# Altium schematic sheet 1_P1.schdoc
size 429 x 307 mm; Symbol: Sheet-Symbol_A4; Device: Sheet-Symbol_A4; Company: terrence@tenclass.com; Version: V3.2; Page Size: A4; @Project Name: 小x宝bot; @Page Count: 1; @Update Date: 2025-09-04; @Create Date: 2025-09-04; @Schematic Name: SCH_3636_v3; @Page No: 1; @Page Name: P1; @Board Name: c3_8311_3636_v3; @Create Time: 12:12:51; @Update Time: 12:13:00; Width: 1655; Height: 1170; Region Start: 1; X Region Count: 6; Y Region Count: 4; Blade Width: 10; Title Block Position: 3
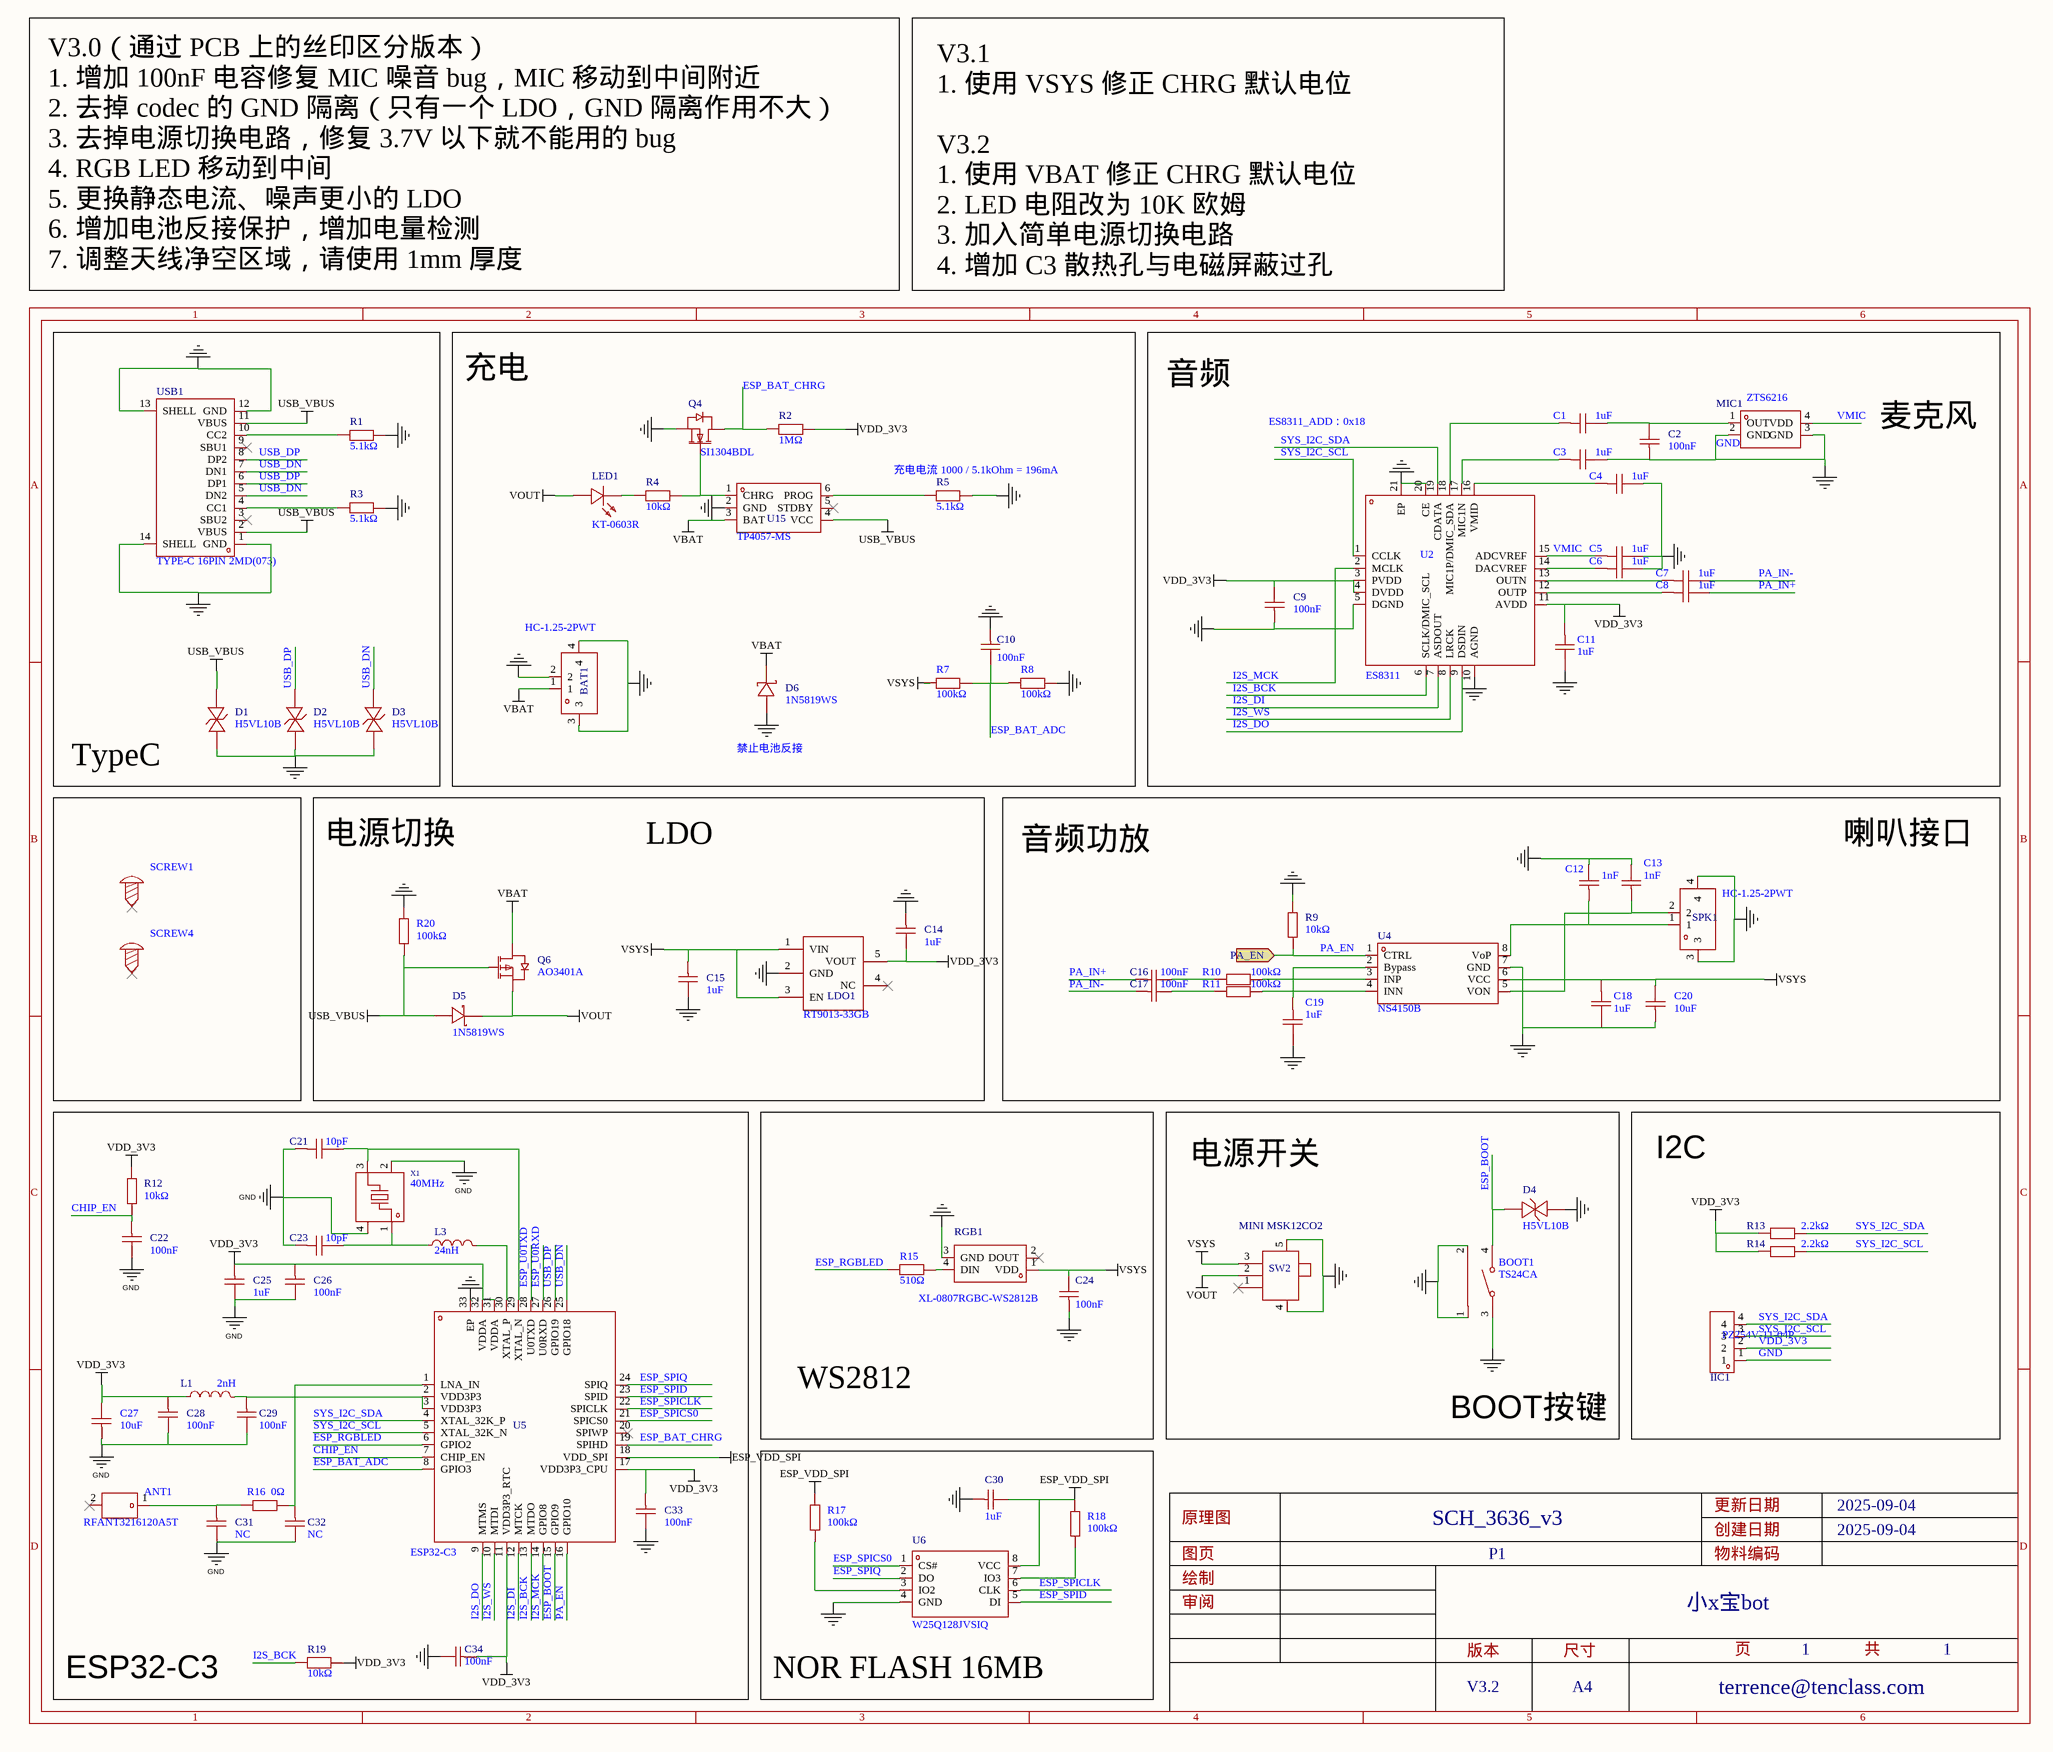
[diagram p0: 1_P1.schdoc]

## Parts
ANT1  RFANT3216120A5T  [FILTER-SMD_1206-2P-L3.2-W1.6-L]
BAT1  HC-1.25-2PWT  [CONN-SMD_2P-P1.25-HC-1.25-2PWT]
BOOT1  TS24CA  [SW-SMD_TS24CA]
C1  1uF  [C0402]
C2  100nF  [C0402]
C3  1uF  [C0402]
C4  1uF  [C0402]
C5  1uF  [C0402]
C6  1uF  [C0402]
C7  1uF  [C0402]
C8  1uF  [C0402]
C9  100nF  [C0402]
C10  100nF  [C0402]
C11  1uF  [C0402]
C12  1nF  [C0402]
C13  1nF  [C0402]
C14  1uF  [C0402]
C15  1uF  [C0402]
C16  100nF  [C0402]
C17  100nF  [C0402]
C18  1uF  [C0402]
C19  1uF  [C0402]
C20  10uF  [C0402]
C21  10pF  [C0402]
C22  100nF  [C0402]
C23  10pF  [C0402]
C24  100nF  [C0402]
C25  1uF  [C0402]
C26  100nF  [C0402]
C27  10uF  [C0402]
C28  100nF  [C0402]
C29  100nF  [C0402]
C30  1uF  [C0402]
C31  NC  [C0402]
C32  NC  [C0402]
C33  100nF  [C0402]
C34  100nF  [C0402]
D1  H5VL10B  [SOD-882_L1.0-W0.6-BI]
D2  H5VL10B  [SOD-882_L1.0-W0.6-BI]
D3  H5VL10B  [SOD-882_L1.0-W0.6-BI]
D4  H5VL10B  [SOD-882_L1.0-W0.6-BI]
D5  1N5819WS  [SOD-323_L1.8-W1.3-LS2.5-RD]
D6  1N5819WS  [SOD-323_L1.8-W1.3-LS2.5-RD]
IIC1  PZ254V-11-04P  [HDR-TH_4P-P2.54-V-M]
L1  2nH  [L0402]
L3  24nH  [L0402-RD]
LDO1  RT9013-33GB  [SOT-23-5_L3.0-W1.7-P0.95-LS2.8-BL]
LED1  KT-0603R  [LED0603-RD]
MIC1  ZTS6216  [MIC-SMD_4P-L2.8-W1.9-P1.84-TL]
Q4  SI1304BDL  [SOT-323-3_L2.0-W1.3-P1.30-LS2.1-BL]
Q6  AO3401A  [SOT-23_L2.9-W1.3-P1.90-LS2.4-BR]
R1  5.1kΩ  [R0402]
R2  1MΩ  [R0402]
R3  5.1kΩ  [R0402]
R4  10kΩ  [R0402]
R5  5.1kΩ  [R0402]
R7  100kΩ  [R0402]
R8  100kΩ  [R0402]
R9  10kΩ  [R0402]
R10  100kΩ  [R0402]
R11  100kΩ  [R0402]
R12  10kΩ  [R0402]
R13  2.2kΩ  [R0402]
R14  2.2kΩ  [R0402]
R15  510Ω  [R0402]
R16  0Ω  [R0402]
R17  100kΩ  [R0402]
R18  100kΩ  [R0402]
R19  10kΩ  [R0402]
R20  100kΩ  [R0402]
RGB1  XL-0807RGBC-WS2812B  [LED-SMD_4P-L2.0-W1.8_CY-0807]
SCREW1  (no value)  [M2螺丝]
SCREW4  (no value)  [M2螺丝]
SPK1  HC-1.25-2PWT  [CONN-SMD_2P-P1.25-HC-1.25-2PWT]
SW2  MINI MSK12CO2  [SW-SMD_MSK12CO2]
U2  ES8311  [WQFN-20_L3.0-W3.0-P0.40-BL-EP1.7]
U4  NS4150B  [MSOP-8_L3.0-W3.0-P0.65-LS5.0-BL]
U5  ESP32-C3  [QFN-32_L5.0-W5.0-P0.50-TL-EP3.7]
U6  W25Q128JVSIQ  [SOIC-8_L5.3-W5.3-P1.27-LS8.0-BL]
U15  TP4057-MS  [SOT-23-6_L2.9-W1.6-P0.95-LS2.8-BL]
USB1  TYPE-C 16PIN 2MD(073)  [USB-C-SMD_TYPE-C-6PIN-2MD-073]
X1  40MHz  [CRYSTAL-SMD_4P-L2.5-W2.0-BL]

## Blocks framed on the sheet
TypeC: D1-D3 R1 R3 USB1
充电: BAT1 C10 D6 LED1 Q4 R2 R4 R5 R7 R8 U15
ESP32-C3: ANT1 C21-C23 C25-C29 C31-C34 L1 L3 R12 R16 R19 U5 X1
WS2812: C24 R15 RGB1
I2C: IIC1 R13 R14
NOR FLASH 16MB: C30 R17 R18 U6

## Ports
PA_EN (in)

## Nets
ESP_VDD_SPI: C30.2 R17.2 R18.2 U5.18(VDD_SPI) U6.8(VCC)
GND: BAT1.2 BAT1.3 BAT1.4 BOOT1.1 BOOT1.2 BOOT1.3 C2.1 C3.1 C4.1 C5.1 C6.1 C9.1 C10.1 C11.1 C12.2 C13.2 C14.1 C15.2 C18.1 C19.1 C20.1 C21.2 C22.2 C23.2 C24.1 C25.2 C26.2 C27.1 C28.2 C29.2 C30.1 C31.2 C32.2 C33.2 C34.2 D1.2(A) D2.2(A) D3.2(A) D4.2(A) D6.2(A) IIC1.1 LDO1.2(GND) MIC1.2(GND) MIC1.3(GND) Q4.2(S) R1.2 R3.2 R5.2 R8.2 R9.2 R20.2 RGB1.3(GND) SPK1.3 SPK1.4 SW2.4 SW2.5 U2.5(DGND) U2.10(AGND) U2.20(CE) U2.21(EP) U4.7(GND) U5.33(EP) U6.4(GND) U15.2(GND) USB1.1(GND) USB1.12(GND) USB1.13(SHELL) USB1.14(SHELL) X1.2(GND) X1.4(GND)
USB_VBUS: D1.1(C) D5.2(A) Q6.1(G) R20.1 U15.4(VCC) USB1.2(VBUS) USB1.11(VBUS)
VBAT: BAT1.1 D6.1(K) Q6.3(D) U15.3(BAT)
VDD_3V3: C9.2 C11.2 C14.2 C25.1 C26.1 C27.2 C28.1 C33.1 C34.1 IIC1.2 L1.1 LDO1.5(VOUT) R2.1 R12.1 R13.2 R14.2 R19.1 U2.3(PVDD) U2.4(DVDD) U2.11(AVDD) U5.11(VDD3P3_RTC) U5.17(VDD3P3_CPU) U5.31(VDDA) U5.32(VDDA)
VOUT: D5.1(K) LED1.2(A) Q6.2(S) SW2.2
VSYS: C15.1 C18.2 C20.2 C24.2 LDO1.1(VIN) LDO1.3(EN) R7.1 RGB1.1(VDD) SW2.3 U4.6(VCC)
CHIP_EN: C22.1 R12.2 U5.7(CHIP_EN)
ESP_BAT_ADC: C10.2 R7.2 R8.1 U5.8(GPIO3)
ESP_BAT_CHRG: Q4.3(D) R2.2 U5.19(SPIHD)
ESP_BOOT: BOOT1.4 D4.1(C) U5.15(GPIO9)
ESP_RGBLED: R15.2 U5.6(GPIO2)
ESP_SPICLK: U5.22(SPICLK) U6.6(CLK)
ESP_SPICS0: U5.21(SPICS0) U6.1(CS#)
ESP_SPID: U5.23(SPID) U6.5(DI)
ESP_SPIQ: U5.24(SPIQ) U6.2(DO)
ESP_U0RXD: U5.27(U0RXD)
ESP_U0TXD: U5.28(U0TXD)
I2S_BCK: R19.2 U2.6(SCLK/DMIC_SCL) U5.13(MTDO)
I2S_DI: U2.7(ASDOUT) U5.12(MTCK)
I2S_DO: U2.9(DSDIN) U5.9(MTMS)
I2S_MCK: U2.2(MCLK) U5.14(GPIO8)
I2S_WS: U2.8(LRCK) U5.10(MTDI)
PA_EN: R9.1 U4.1(CTRL) U5.16(GPIO10) ; port PA_EN
PA_IN+: C8.1 C16.1
PA_IN-: C7.1 C17.1
SYS_I2C_SCL: IIC1.3 R14.1 U2.1(CCLK) U5.5(XTAL_32K_N)
SYS_I2C_SDA: IIC1.4 R13.1 U2.19(CDATA) U5.4(XTAL_32K_P)
USB_DN: D3.1(C) U5.25(GPIO18) USB1.5(DN2) USB1.7(DN1)
USB_DP: D2.1(C) U5.26(GPIO19) USB1.6(DP1) USB1.8(DP2)
VMIC: C5.2 MIC1.4(VDD) U2.15(ADCVREF)
NetANT1_1: ANT1.1 C31.1 R16.1
NetC1_1: C1.1 C2.2 MIC1.1(OUT)
NetC1_2: C1.2 U2.18(MIC1P/DMIC_SDA)
NetC3_2: C3.2 U2.17(MIC1N)
NetC4_2: C4.2 U2.16(VMID)
NetC6_2: C6.2 U2.14(DACVREF)
NetC7_2: C7.2 U2.13(OUTN)
NetC8_2: C8.2 U2.12(OUTP)
NetC12_1: C12.1 SPK1.1 U4.8(VoP)
NetC13_1: C13.1 SPK1.2 U4.5(VON)
NetC16_2: C16.2 R10.2
NetC17_2: C17.2 R11.2
NetC19_2: C19.2 U4.2(Bypass)
NetC21_1: C21.1 U5.29(XTAL_N) X1.3
NetC23_1: C23.1 L3.1 X1.1
NetC29_1: C29.1 L1.2 U5.2(VDD3P3) U5.3(VDD3P3)
NetC32_1: C32.1 R16.2 U5.1(LNA_IN)
NetL3_2: L3.2 U5.30(XTAL_P)
NetLED1_1: LED1.1(K) R4.1
NetQ4_1: Q4.1(G) R4.2 U15.1(CHRG)
NetR1_1: R1.1 USB1.10(CC2)
NetR3_1: R3.1 USB1.4(CC1)
NetR5_1: R5.1 U15.6(PROG)
NetR10_1: R10.1 U4.3(INP)
NetR11_1: R11.1 U4.4(INN)
NetR15_1: R15.1 RGB1.4(DIN)
NetR17_1: R17.1 U6.3(IO2)
NetR18_1: R18.1 U6.7(IO3)

Not connected (* = marked no-connect by the designer): ANT1 2*; LDO1 4(NC)*; RGB1 2(DOUT)*; SCREW1 1*; SCREW4 1*; SW2 1*; U5 20(SPIWP)*; U15 5(STDBY)*; USB1 3(SBU2)* 9(SBU1)*

## Notes on the sheet
- V3.0（通过 PCB 上的丝印区分版本）
  1. 增加 100nF 电容修复 MIC 噪音 bug，MIC 移动到中间附近
  2. 去掉 codec 的 GND 隔离（只有一个 LDO，GND 隔离作用不大）
  3. 去掉电源切换电路，修复 3.7V 以下就不能用的 bug
  4. RGB LED 移动到中间
  5. 更换静态电流、噪声更小的 LDO
  6. 增加电池反接保护，增加电量检测
  7. 调整天线净空区域，请使用 1mm 厚度
- V3.1
  1. 使用 VSYS 修正 CHRG 默认电位
  V3.2
  1. 使用 VBAT 修正 CHRG 默认电位
  2. LED 电阻改为 10K 欧姆
  3. 加入简单电源切换电路
  4. 增加 C3 散热孔与电磁屏蔽过孔
- 音频
- ES8311_ADD：0x18
- 麦克风
- (near R5) 充电电流 1000 / 5.1kOhm = 196mA
- 禁止电池反接
- 电源切换
- LDO
- 音频功放
- 喇叭接口
- 电源开关
- BOOT按键
- 1
- 2
- 3
- 4
- 5
- 6
- A
- B
- C
- 原理图
- SCH_3636_v3
- 创建日期
- 更新日期
- 2025-09-04
- D
- 绘制
- 图页
- P1
- 物料编码
- 审阅
- 版本
- 尺寸
- 小x宝bot
- 页
- 共
- V3.2
- A4
- terrence@tenclass.com

## Library data of the parts
ANT1 = RFANT3216120A5T: Manufacturer: Walsin(华新科); Add into BOM: yes; Antenna Type: 芯片天线; Central Frequency: 2.4GHz; Peak Gain: 2dBi; VSWR: 2; Symbol: RFANT3216120A5T; Device: RFANT3216120A5T; LCSC Part Name: 2.4GHz ISM频段工作频率的多层陶瓷天线; Supplier Part: C127629; Manufacturer Part: RFANT3216120A5T; Supplier Footprint: 1206; JLCPCB Part Class: Extended Part; Datasheet: https://atta.szlcsc.com/upload/public/pdf/source/20180326/C127629_E7A81F7A36316F7BB6F0FA74BB27F225.pdf; Supplier: LCSC; Convert to PCB: yes; Bandwidth: -; Polarization Type: -; Impedance: -; Power capacity: -; Operating Temperature: -40℃~+85℃
BAT1 SPK1 = HC-1.25-2PWT: Manufacturer: HCTL(华灿天禄); Add into BOM: yes; Pins Structure: 1x2P; Pitch: 1.25mm; Reference Series: PicoBlade(MX 1.25); Number of PINs Per Row: 2; Current Rating (Max): 1A; Rated Voltage (Max): 125V; Plastic Material: LCP; Flame Retardant Rating: UL94V-0; Supplementary Features: 辅助焊脚; Z-Height of the Board: 3.57mm; X-Length of Bottom Edge on Board (Spacing Line): 7.55mm; Y-Width of Bottom Edge on Board: 5.25mm; Symbol: HC-1.25-2PWT; Device: HC-1.25-2PWT; LCSC Part Name: 1x2P 间距:1.25mm 卧贴 系列:PicoBlade(MX 1.25); Supplier Part: C2845379; Manufacturer Part: HC-1.25-2PWT; Supplier Footprint: SMD,P=1.25mm,卧贴; JLCPCB Part Class: Extended Part; Datasheet: https://atta.szlcsc.com/upload/public/pdf/source/20240930/9508A8292CCC87B0C29E3A028D56E30A.pdf; Supplier: LCSC; Convert to PCB: yes; Mounting Style: 卧贴; Number of Pins: 2P; Number of Rows: 1; Row Spacing: -; Contact Material: 黄铜; Contact Plating: 锡; Operating Temperature Range: -40℃~+105℃; Colour: -
BOOT1 = TS24CA: Manufacturer: SHOU HAN(首韩); Add into BOM: yes; Circuit: 单刀单掷; Actuator Style: 矩形按钮; Switch Length: 4.55mm; Switch Width: 1.8mm; Switch Height: 3.5mm; Contact Current: 50mA; Voltage Rating (DC): 12V; Symbol: TS24CA; Device: TS24CA; LCSC Part Name: 4.55*1.8*3.5mm 卧贴 轻触开关; Supplier Part: C393942; Manufacturer Part: TS24CA; Supplier Footprint: SMD; JLCPCB Part Class: Extended Part; Datasheet: https://atta.szlcsc.com/upload/public/pdf/source/20190521/C393942_591A9E318887EFA4274D34029981AD99.pdf; Supplier: LCSC; Convert to PCB: yes; Mounting Style: 卧贴; With Lamp: -; Mechanical Life: -
C1 C3 = CL05A105KA5NQNC: Manufacturer: SAMSUNG(三星); Add into BOM: yes; Tolerance: ±10%; Voltage Rated: 25V; Temperature Coefficient: X5R; Symbol: CL05A105KA5NQNC; Device: CL05A105KA5NQNC; LCSC Part Name: 1uF ±10% 25V; Supplier Part: C52923; Manufacturer Part: CL05A105KA5NQNC; Supplier Footprint: 0402; JLCPCB Part Class: Basic Part; Datasheet: https://atta.szlcsc.com/upload/public/pdf/source/20160218/1457707763339.pdf; Supplier: LCSC; Convert to PCB: yes; Value: 1uF
C2 C9 C31 C32 = CL05B104KO5NNNC: Manufacturer: SAMSUNG(三星); Add into BOM: yes; Tolerance: ±10%; Voltage Rated: 16V; Temperature Coefficient: X7R; Symbol: CL05B104KO5NNNC; Device: CL05B104KO5NNNC; Supplier: LCSC; Manufacturer Part: CL05B104KO5NNNC; LCSC Part Name: 100nF ±10% 16V; Supplier Footprint: 0402; Datasheet: https://atta.szlcsc.com/upload/public/pdf/source/20160218/1457707763339.pdf; Convert to PCB: yes
  C2 C9: Value: 100nF; Supplier Part: C1525; JLCPCB Part Class: Basic Part
  C31 C32: Value: NC
C4-C8 C11 C18 C19 = CL05A105KA5NQNC: Manufacturer: SAMSUNG(三星); Add into BOM: yes; Tolerance: ±10%; Voltage Rated: 25V; Temperature Coefficient: X5R; Check: true; Symbol: CL05A105KA5NQNC; Device: CL05A105KA5NQNC; LCSC Part Name: 1uF ±10% 25V; Supplier Part: C52923; Manufacturer Part: CL05A105KA5NQNC; Supplier Footprint: 0402; Datasheet: https://atta.szlcsc.com/upload/public/pdf/source/20160103/1457707735223.pdf; Supplier: LCSC; Convert to PCB: yes; Value: 1uF
C10 C16 C17 C22 C24 C26 C28 C29 C33 C34 = CL05B104KO5NNNC: Manufacturer: SAMSUNG(三星); Add into BOM: yes; Tolerance: ±10%; Voltage Rated: 16V; Temperature Coefficient: X7R; Check: true; Symbol: CL05B104KO5NNNC; Device: CL05B104KO5NNNC; Supplier: LCSC; Manufacturer Part: CL05B104KO5NNNC; Value: 100nF; Supplier Part: C1525; LCSC Part Name: 100nF ±10% 16V; Supplier Footprint: 0402; Datasheet: https://atta.szlcsc.com/upload/public/pdf/source/20160218/1457707763339.pdf; Convert to PCB: yes
C12 C13 = 0402B102K500NT: Manufacturer: FH(风华); Add into BOM: yes; Tolerance: ±10%; Voltage Rated: 50V; Temperature Coefficient: X7R; Symbol: 0402B102K500NT; Device: 0402B102K500NT; Supplier: LCSC; Manufacturer Part: 0402B102K500NT; Capacitance: 1nF; Supplier Part: C1523; JLCPCB Part Class: Basic Part; LCSC Part Name: 1nF ±10% 50V; Supplier Footprint: 0402; Datasheet: https://atta.szlcsc.com/upload/public/pdf/source/20200305/C486355_26A10D38EF8C2A5C37091D0039909270.pdf; Convert to PCB: yes; Value: 1nF
C14 C15 C25 C30 = CL05A105KA5NQNC: Manufacturer: SAMSUNG(三星); Symbol: CL05B104KO5NNNC; Add into BOM: yes; Tolerance: ±10%; Voltage Rated: 25V; Temperature Coefficient: X5R; Check: true; Device: CL05A105KA5NQNC; Supplier: LCSC; Manufacturer Part: CL05A105KA5NQNC; Value: 1uF; Supplier Part: C52923; JLCPCB Part Class: Basic Part; LCSC Part Name: 1uF ±10% 25V; Supplier Footprint: 0402; Datasheet: https://atta.szlcsc.com/upload/public/pdf/source/20160218/1457707763339.pdf; Convert to PCB: yes
C20 C27 = CL05A106MQ5NUNC: Manufacturer: SAMSUNG(三星); Add into BOM: yes; Tolerance: ±20%; Voltage Rated: 6.3V; Temperature Coefficient: X5R; Symbol: CL05A106MQ5NUNC; Device: CL05A106MQ5NUNC; LCSC Part Name: 10uF ±20% 6.3V; Supplier Part: C15525; Manufacturer Part: CL05A106MQ5NUNC; Supplier Footprint: 0402; JLCPCB Part Class: Basic Part; Datasheet: https://atta.szlcsc.com/upload/public/pdf/source/20220823/2B02EE04F8F211D38A52DCB16EB6BEBA.pdf; Supplier: LCSC; Convert to PCB: yes; Value: 10uF
C21 C23 = CL05C100JB5NNNC: Manufacturer: SAMSUNG(三星); Add into BOM: yes; Tolerance: ±5%; Voltage Rated: 50V; Temperature Coefficient: C0G; Symbol: CL05C100JB5NNNC; Device: CL05C100JB5NNNC; LCSC Part Name: 10pF ±5% 50V; Supplier Part: C32949; Manufacturer Part: CL05C100JB5NNNC; Supplier Footprint: 0402; JLCPCB Part Class: Basic Part; Datasheet: https://atta.szlcsc.com/upload/public/pdf/source/20160218/1457707763339.pdf; Supplier: LCSC; Convert to PCB: yes; Value: 10pF
D1-D4 = H5VL10B: Manufacturer: R+O(宏嘉诚); Add into BOM: yes; polarity: 双向; Reverse Stand-Off Voltage (Vrwm): 5V; Maximum Clamping Voltage: 10V; Peak Pulse Current (Ipp): 5A; Peak Pulse Power Dissipation (Ppp): 50W; Breakdown Voltage: 5.6V; Reverse Leakage Current (Ir): 100nA; Number of Lines: 单路; level of protection: IEC 61000-4-2；IEC 61000-4-5; Type: ESD; Junction Capacitance: 15pF; Symbol: H5VL10B; Device: H5VL10B; LCSC Part Name: 丝印 PB 双向ESD 5V截止 峰值浪涌电流：5A; Supplier Part: C7420372; Manufacturer Part: H5VL10B; Supplier Footprint: DFN1006-2L; JLCPCB Part Class: Extended Part; Datasheet: https://item.szlcsc.com/datasheet/H5VL10B/8397194.html; Supplier: LCSC; Convert to PCB: yes; Operating Temperature: -55℃~+125℃; Polarity: 双向; Clamping Voltage: 10V; Voltage - Breakdown: 5.6V; Number of Channels: 单路
D5 D6 = 1N5819WS_C191023: Manufacturer: Hottech(合科泰); Add into BOM: yes; Forward Voltage (Vf@If): 600mV@1A; Reverse Voltage (Vr): 40V; Average Rectified Current (Io): 1A; Symbol: 1N5819WS; Device: 1N5819WS_C191023; LCSC Part Name: 电压:40V 电流:1A; Supplier Part: C191023; Manufacturer Part: 1N5819WS; Supplier Footprint: SOD-323; JLCPCB Part Class: 基础库; Datasheet: https://atta.szlcsc.com/upload/public/pdf/source/20220428/3CB86FD8D28D653594B4E35F9D5AEFD9.pdf; Supplier: LCSC; Convert to PCB: yes
IIC1 = PZ254V-11-04P: Manufacturer: XFCN(兴飞); Symbol: PZ254V-11-04P_C2691448; Add into BOM: yes; Pin Structure: 1x4P; Pitch: 2.54mm; Circluar Pins/Square Pins: 方针; Current Rating (Max): 3A; Voltage Rating (Max): 250V; Device: PZ254V-11-04P; LCSC Part Name: 间距:2.54mm 1x4P 直插 方针; Supplier Part: C2691448; Manufacturer Part: PZ254V-11-04P; Supplier Footprint: 插件,P=2.54mm; JLCPCB Part Class: Extended Part; Datasheet: https://atta.szlcsc.com/upload/public/pdf/source/20200309/C492403_F9F19131791D08044AD4F84F8E751A34.pdf; Supplier: LCSC; Convert to PCB: yes; Row Spacing: -; Mounting Type: 直插; Number of Rows: 单排; Number of Pins: 4P; Length of Mating Pin: 6mm; Insulation Height: 2.5mm; Length of End Connection Pin: 3mm; Contact Material: -; Operating Temperature Range: -40℃~+105℃; Color: 黑色
L1 = LQG15HS2N0S02D: Manufacturer: muRata(村田); Add into BOM: yes; Rated Current: 900mA; DC Resistance (DCR): 90mΩ; Q @ Freq: 8@100MHz; Frequency - Self Resonant: 6GHz; Check: true; Symbol: LQG15HS2N0S02D; Device: LQG15HS2N0S02D; LCSC Part Name: 2nH ±0.3nH; Supplier Part: C18216; Manufacturer Part: LQG15HS2N0S02D; Supplier Footprint: 0402; Datasheet: https://atta.szlcsc.com/upload/public/pdf/source/20190514/C18216_4C6D770518CF7A3B206943E09D2940CE.pdf; Supplier: LCSC; Convert to PCB: yes; Value: 2nH; Tolerance: -; Saturation Current (Isat): -; Ratings: -
L3 = SDCL1005C24NJTDF: Manufacturer: Sunlord(顺络); Add into BOM: yes; Tolerance: ±5%; Check: true; Symbol: SDCL1005C24NJTDF; Device: SDCL1005C24NJTDF; LCSC Part Name: 24nH ±5%; Supplier Part: C74301; Manufacturer Part: SDCL1005C24NJTDF; Supplier Footprint: 0402; Datasheet: https://atta.szlcsc.com/upload/public/pdf/source/20210916/2389196E6DC4CA1121B2D3610B126F46.pdf; Supplier: LCSC; Convert to PCB: yes; Value: 24nH; Rated Current: -; Saturation Current (Isat): -; DC Resistance (DCR): -; Q @ Freq: -; Frequency - Self Resonant: -; Ratings: -
LDO1 = RT9013-33GB: Manufacturer: RICHTEK(立锜); Add into BOM: yes; Output Type: 固定; Maximum Input Voltage: 5.5V; Output Voltage: 3.3V; Output Current: 500mA; Power Supply Rejection Ratio (PSRR): 50dB@(10kHz); Dropout Voltage: 400mV@(500mA); standby current: 50uA; Output Polarity: 正极; Number of Outputs: 1; Symbol: RT9013-33GB; Device: RT9013-33GB; LCSC Part Name: 输入5.5V 输出3.3V 500mA; Supplier Part: C47773; Manufacturer Part: RT9013-33GB; Supplier Footprint: SOT-23-5; JLCPCB Part Class: Extended Part; Datasheet: https://atta.szlcsc.com/upload/public/pdf/source/20150504/1457707282459.pdf; Supplier: LCSC; Convert to PCB: yes; Noise: -; Feature: 低ESR；防静电保护；热保护(TSD)；过流保护(OCP)；带使能; Operating Temperature: -40℃~+85℃
LED1 = KT-0603R: Manufacturer: KENTO; Add into BOM: yes; Emitted Color: 红色; Symbol: KT-0603R; Device: KT-0603R; LCSC Part Name: 0603 红灯 高亮; Supplier Part: C2286; Manufacturer Part: KT-0603R; Supplier Footprint: 0603; JLCPCB Part Class: 基础库; Datasheet: https://atta.szlcsc.com/upload/public/pdf/source/20160616/1466072038404.pdf; Supplier: LCSC; Convert to PCB: yes; Power Dissipation: -; Forward Current: -; Dominant Wavelength: -; Peak Wavelength: -; Diode Configuration: -; Lens Color: -; Color Temperature: -; Viewing Angle: -; Mounting Sytle: -; Operating Temperature: -40℃~+85℃
MIC1 = ZTS6216: Manufacturer: ZILLTEK(钰太); Add into BOM: yes; Direction: 全指向; Sensitivity: -38dB; SNR(Signal to Noise Ratio): 65dB; Current Consumption: 120uA; Supply Voltage: 1.5V~3.6V; Impedance: 100Ω; Symbol: ZTS6216; Device: ZTS6216; LCSC Part Name: ZTS6216; Supplier Part: C481302; Manufacturer Part: ZTS6216; Supplier Footprint: SMD-4P,1.9x2.8mm; JLCPCB Part Class: Extended Part; Datasheet: https://atta.szlcsc.com/upload/public/pdf/source/20200316/C481302_3CBECE2A7DED4DFD53CEA082844189F4.pdf; Supplier: LCSC; Convert to PCB: yes
Q4 = SI1304BDL: Manufacturer: TECH PUBLIC(台舟); Symbol: SI1304BDL_C7419947; Add into BOM: yes; Drain to Source Voltage: 30V; Current - Continuous Drain(Id): 800mA; RDS(on): 450mΩ@4.5V,0.5A; Pd - Power Dissipation: 360mW; Gate Threshold Voltage (Vgs(th)@Id): 1.2V; Gate Charge(Qg): 5.2nC@4.5V; Input Capacitance(Ciss@Vds): 146pF@15V; Reverse Transfer Capacitance (Crss@Vds): 14.8pF@15V; Device: SI1304BDL; LCSC Part Name: 耐压:30V 电流:800mA; Supplier Part: C7419947; Manufacturer Part: SI1304BDL; Supplier Footprint: SOT323; JLCPCB Part Class: 扩展库; Datasheet: https://atta.szlcsc.com/upload/public/pdf/source/20230614/29177D84C02B773E5013B7ECF602DE54.pdf; Supplier: LCSC; Convert to PCB: yes; Operating Temperature: -55℃~+150℃
Q6 = AO3401A_C347476: Manufacturer: UMW(友台半导体); Add into BOM: yes; Type: 1个P沟道; Drain Source Voltage (Vdss): 30V; Continuous Drain Current (Id): 4.2A; Drain Source On Resistance (RDS(on)@Vgs,Id): 50mΩ@10V; Power Dissipation (Pd): 1.4W; Gate Threshold Voltage (Vgs(th)@Id): 400mV@250uA; Total Gate Charge (Qg@Vgs): 9.4nC@4.5V; Input Capacitance (Ciss@Vds): 954pF; Reverse Transfer Capacitance (Crss@Vds): 77pF; Symbol: AO3401A_C347476; Device: AO3401A_C347476; LCSC Part Name: 1个P沟道 耐压:30V 电流:4.2A; Supplier Part: C347476; Manufacturer Part: AO3401A; Supplier Footprint: SOT-23; JLCPCB Part Class: 扩展库; Datasheet: https://atta.szlcsc.com/upload/public/pdf/source/20231109/42F312EBB081D72F04A7E8221BFFAF9D.pdf; Supplier: LCSC; Convert to PCB: yes; Operating Temperature: -55℃~+150℃
R1 R3 R5 = 0402WGF5101TCE: Manufacturer: UNI-ROYAL(厚声); Add into BOM: yes; Tolerance: ±1%; Power(Watts): 62.5mW; Overload Voltage (Max): 50V; Temperature Coefficient: ±100ppm/℃; Check: true; Symbol: 0402WGF5101TCE; Device: 0402WGF5101TCE; LCSC Part Name: 5.1kΩ ±1% 62.5mW 厚膜电阻; Supplier Part: C25905; Manufacturer Part: 0402WGF5101TCE; Supplier Footprint: 0402; JLCPCB Part Class: 基础库; Datasheet: https://atta.szlcsc.com/upload/public/pdf/source/20200306/C422600_1E6D84923E4A46A82E41ADD87F860B5C.pdf; Supplier: LCSC; Convert to PCB: yes; Type: 厚膜电阻; Value: 5.1kΩ; Operating Temperature Range: -55℃~+155℃
R2 = 0402WGF1004TCE: Manufacturer: UNI-ROYAL(厚声); Add into BOM: yes; Tolerance: ±1%; Power(Watts): 62.5mW; Overload Voltage (Max): 50V; Temperature Coefficient: ±100ppm/℃; Symbol: 0402WGF1004TCE; Device: 0402WGF1004TCE; LCSC Part Name: 1MΩ ±1% 62.5mW 厚膜电阻; Supplier Part: C26083; Manufacturer Part: 0402WGF1004TCE; Supplier Footprint: 0402; JLCPCB Part Class: 基础库; Datasheet: https://atta.szlcsc.com/upload/public/pdf/source/20200306/C422600_1E6D84923E4A46A82E41ADD87F860B5C.pdf; Supplier: LCSC; Convert to PCB: yes; Type: 厚膜电阻; Value: 1MΩ; Operating Temperature Range: -55℃~+155℃
R4 R9 R12 R19 = 0402WGF1002TCE: Manufacturer: UNI-ROYAL(厚声); Add into BOM: yes; Tolerance: ±1%; Power(Watts): 62.5mW; Temperature Coefficient: ±100ppm/℃; Overload Voltage (Max): 50V; Check: true; Symbol: 0402WGF1002TCE; Device: 0402WGF1002TCE; Supplier: LCSC; Manufacturer Part: 0402WGF1002TCE; Supplier Part: C25744; Value: 10kΩ; LCSC Part Name: 厚膜电阻 10kΩ ±1% 62.5mW; Supplier Footprint: 0402; Datasheet: https://atta.szlcsc.com/upload/public/pdf/source/20200306/C422600_1E6D84923E4A46A82E41ADD87F860B5C.pdf; Convert to PCB: yes; Type: 厚膜电阻; Operating Temperature Range: -55℃~+155℃
R7 R8 R10 R11 R17 R18 R20 = 0402WGF1003TCE: Manufacturer: UNI-ROYAL(厚声); Add into BOM: yes; Tolerance: ±1%; Power(Watts): 62.5mW; Temperature Coefficient: ±100ppm/℃; Overload Voltage (Max): 50V; Check: true; Symbol: 0402WGF1003TCE; Device: 0402WGF1003TCE; LCSC Part Name: 100kΩ ±1% 62.5mW; Supplier Part: C25741; Manufacturer Part: 0402WGF1003TCE; Supplier Footprint: 0402; JLCPCB Part Class: 基础库; Datasheet: https://atta.szlcsc.com/upload/public/pdf/source/20200306/C422600_1E6D84923E4A46A82E41ADD87F860B5C.pdf; Supplier: LCSC; Convert to PCB: yes; Type: 厚膜电阻; Value: 100kΩ; Operating Temperature Range: -55℃~+155℃
R13 R14 = 0402WGF2201TCE: Manufacturer: UNI-ROYAL(厚声); Add into BOM: yes; Tolerance: ±1%; Power(Watts): 62.5mW; Overload Voltage (Max): 50V; Temperature Coefficient: ±100ppm/℃; Symbol: 0402WGF2201TCE; Device: 0402WGF2201TCE; LCSC Part Name: 2.2kΩ ±1% 62.5mW 厚膜电阻; Supplier Part: C25879; Manufacturer Part: 0402WGF2201TCE; Supplier Footprint: 0402; JLCPCB Part Class: Basic Part; Datasheet: https://atta.szlcsc.com/upload/public/pdf/source/20200306/C422600_1E6D84923E4A46A82E41ADD87F860B5C.pdf; Supplier: LCSC; Convert to PCB: yes; Type: 厚膜电阻; Value: 2.2kΩ; Operating Temperature Range: -55℃~+155℃
R15 = 0402WGF5100TCE: Manufacturer: UNI-ROYAL(厚声); Add into BOM: yes; Tolerance: ±1%; Power(Watts): 62.5mW; Overload Voltage (Max): 50V; Temperature Coefficient: ±100ppm/℃; Symbol: 0402WGF5100TCE; Device: 0402WGF5100TCE; LCSC Part Name: 510Ω ±1% 62.5mW 厚膜电阻; Supplier Part: C25123; Manufacturer Part: 0402WGF5100TCE; Supplier Footprint: 0402; JLCPCB Part Class: Basic Part; Datasheet: https://atta.szlcsc.com/upload/public/pdf/source/20200306/C422600_1E6D84923E4A46A82E41ADD87F860B5C.pdf; Supplier: LCSC; Convert to PCB: yes; Type: 厚膜电阻; Value: 510Ω; Operating Temperature Range: -55℃~+155℃
R16 = 0402WGF0000TCE: Manufacturer: UNI-ROYAL(厚声); Symbol: 电阻; Add into BOM: yes; Tolerance: ±1%; Power(Watts): 62.5mW; Temperature Coefficient: ±800ppm/℃; Overload Voltage (Max): 50V; Check: true; Device: 0402WGF0000TCE; LCSC Part Name: 0Ω ±1% 62.5mW; Supplier Part: C17168; Manufacturer Part: 0402WGF0000TCE; Supplier Footprint: 0402; JLCPCB Part Class: Basic Part; Datasheet: https://atta.szlcsc.com/upload/public/pdf/source/20200306/C422600_1E6D84923E4A46A82E41ADD87F860B5C.pdf; Supplier: LCSC; Convert to PCB: yes; Type: 厚膜电阻; Value: 0Ω; Operating Temperature Range: -55℃~+155℃
RGB1 = XL-0807RGBC-WS2812B: Manufacturer: XINGLIGHT(成兴光); Add into BOM: yes; Symbol: XL-0807RGBC-WS2812B; Device: XL-0807RGBC-WS2812B; LCSC Part Name: XL-0807RGBC-WS2812B; Supplier Part: C3646929; Manufacturer Part: XL-0807RGBC-WS2812B; Supplier Footprint: SMD,1.8x2mm; JLCPCB Part Class: Extended Part; Datasheet: https://atta.szlcsc.com/upload/public/pdf/source/20240425/FBA1DE2CE43C49AF299A857148D0DC5F.pdf; Supplier: LCSC; Convert to PCB: yes
SCREW1 SCREW4 = M2螺丝: Symbol: 螺丝孔; Convert to PCB: yes; Device: M2螺丝; Add into BOM: yes; Supplier Footprint: 插件
SW2 = MINI MSK12CO2: Manufacturer: SHOU HAN(首韩); Add into BOM: yes; Circuit: 单刀双掷; Pin Style: SMD接片; Switch Length: 5mm; Switch Width: 2.75mm; Switch Height: 1.4mm; Current Rating (DC): 50mA; Voltage Rating (DC): 12V; Mechanical Life: 1万次; Symbol: MINI MSK12CO2; Device: MINI MSK12CO2; LCSC Part Name: 迷你七脚两档侧拨拨动 mini七7脚 微型拨动; Supplier Part: C2681570; Manufacturer Part: MINI MSK12CO2; Supplier Footprint: SMD; JLCPCB Part Class: 扩展库; Datasheet: https://atta.szlcsc.com/upload/public/pdf/source/20210224/C2681570_D263F9C605E4588A4AE6114B72AE4C72.pdf; Supplier: LCSC; Convert to PCB: yes; Actuator Style: -; Mounting Style: 卧贴; Actuator Color: -; Current Rating (AC): -; Voltage Rating (AC): -; Operating Temperature: -16℃~+60℃
U2 = ES8311: Manufacturer: Everest-semi(顺芯); Add into BOM: yes; Check: true; Symbol: ES8311; Device: ES8311; LCSC Part Name: ES8311; Supplier Part: C962342; Manufacturer Part: ES8311; Supplier Footprint: WQFN-20-EP(3x3); JLCPCB Part Class: 扩展库; Datasheet: https://atta.szlcsc.com/upload/public/pdf/source/20210630/C962342_E665EAE7274179BC7C5A390EC8AC685C.pdf; Supplier: LCSC; Convert to PCB: yes
U4 = NS4150B_C189961: Manufacturer: Nsiway(纳芯威); Symbol: NS4150; Add into BOM: yes; Type of Power Amplifier: Class D; Output Power: 3Wx1@4Ω; Supply Voltage: 3V~5.25V; Check: true; Device: NS4150B_C189961; LCSC Part Name: NS4150B; Supplier Part: C189961; Manufacturer Part: NS4150B; Supplier Footprint: MSOP-8; Datasheet: https://atta.szlcsc.com/upload/public/pdf/source/20220916/DAE631F3909B9CBB38BDE76E3E6D5896.pdf; Supplier: LCSC; Convert to PCB: yes
U5 = ESP32-C3: Manufacturer: ESPRESSIF(乐鑫); Add into BOM: yes; CPU Core: RISC-V; CPU Maximum Speed: 160MHz; Operating Voltage Range: 3V~3.6V; RAM Size: 400KB; GPIO Ports Number: 22; ADC (Bit): 12bit; UART/USART: 2; I2C: 1; SPI: 3; Peripheral/Function: 蓝牙协议栈；片载温度传感器；真随机数发生器；DMA；看门狗；WIFI协议栈；硬件密码算法引擎；54位Timer；PWM；RTC实时时钟; communication protocol: 蓝牙协议；WIFI协议; Watchdog: 有; Check: true; Symbol: ESP32-C3; Device: ESP32-C3; Supplier: LCSC; Supplier Part: C2838500; Manufacturer Part: ESP32-C3; JLCPCB Part Class: 扩展库; LCSC Part Name: ESP32-C3; Supplier Footprint: QFN-32-EP(5x5); Datasheet: https://atta.szlcsc.com/upload/public/pdf/source/20210625/C2838500_6489BE4707B1A2880AF92BF6724D19CA.pdf; Convert to PCB: yes; Program Storage Size: -; Program Memory Type: -; EEPROM: -; DAC (Bit): -; PWM (Bit): -; I2S: 1; Universal Serial Bus: -; Internal Comparator: -; Real-Time Clock: 有; Infrared Data Association: -; Low-Voltage Detect: -; CCP Capture/Compare: -; Secure Digital Input and Output: -; Direct Memory Access: 有; Internal Oscillator: -; Operating Temperature Range: -40℃~+105℃
U6 = W25Q128JVSIQ: Manufacturer: WINBOND(华邦); Symbol: W25Q128JVSIQTR; Add into BOM: yes; Interface Type: SPI; Memory Size: 128Mbit; Clock Frequency (fc): 133MHz; Supply Voltage: 2.7V~3.6V; Page Programming Time (Tpp): 700us; Block Erase Time (tBE): 120ms@(32KB); Data Retention - TDR (Year): 20年; Check: true; Device: W25Q128JVSIQ; LCSC Part Name: W25Q128JVSIQ 编带; Supplier Part: C97521; Manufacturer Part: W25Q128JVSIQ; Supplier Footprint: SOIC-8-208mil; JLCPCB Part Class: 基础库; Datasheet: https://atta.szlcsc.com/upload/public/pdf/source/20170316/1489627409956.pdf; Supplier: LCSC; Convert to PCB: yes; Operating Temperature: -40℃~+85℃
U15 = TP4057-MS: Manufacturer: MSKSEMI(美森科); Add into BOM: yes; Supply Voltage: 0V~9V; Maximum Charge Current: 600mA; Type of Battery: 锂离子/聚合物; Number of Cells: 1; Symbol: TP4057-MS; Device: TP4057-MS; LCSC Part Name: TP4057-MS; Supplier Part: C7473159; Manufacturer Part: TP4057-MS; Supplier Footprint: SOT-23-6; JLCPCB Part Class: 扩展库; Datasheet: https://atta.szlcsc.com/upload/public/pdf/source/20231121/24B008A99AC0DDE2AEA6B6CD8B3686D9.pdf; Supplier: LCSC; Convert to PCB: yes; Operating Temperature: -40℃~+85℃
USB1 = TYPE-C 16PIN 2MD(073): Manufacturer: SHOU HAN(首韩); Add into BOM: yes; Gender: 母; Number of Contacts: 16P; Number of Ports: 1; Current Rating - Power (Max): 5A; Rated Voltage (Max): 5V; Connect-Disconnect Life: 5千次; Core Colour: 黑色; Check: true; Symbol: TYPE-C 16PIN 2MD(073); Device: TYPE-C 16PIN 2MD(073); LCSC Part Name: Type-C 母 卧贴; Supplier Part: C2765186; Manufacturer Part: TYPE-C 16PIN 2MD(073); Supplier Footprint: SMD; JLCPCB Part Class: 扩展库; Datasheet: https://atta.szlcsc.com/upload/public/pdf/source/20211123/39B17C16241EAC15C5E277BDA434118E.pdf; Supplier: LCSC; Convert to PCB: yes; Connector Type: Type-C; Standard: USB 3.1; Mounting Style: 卧贴; Operating Temperature Range: -25℃~+85℃
X1 = X252040MMB4SI: Manufacturer: YXC(扬兴晶振); Add into BOM: yes; Crystal Type: 贴片晶振; Normal temperature Frequency Tolerance: ±10ppm; External load capacitor: 10pF; Frequency Stability(Full temperature range): ±20ppm; Symbol: X252040MMB4SI; Device: X252040MMB4SI; LCSC Part Name: 40MHz ±10ppm 10pF; Supplier Part: C2885592; Manufacturer Part: X252040MMB4SI; Supplier Footprint: SMD2520-4P; JLCPCB Part Class: Extended Part; Datasheet: https://atta.szlcsc.com/upload/public/pdf/source/20240329/8B53C0AFBC5BB264DFB5D72B3757797A.pdf; Supplier: LCSC; Convert to PCB: yes; Value: 40MHz; Operating Temperature: -40℃~+85℃